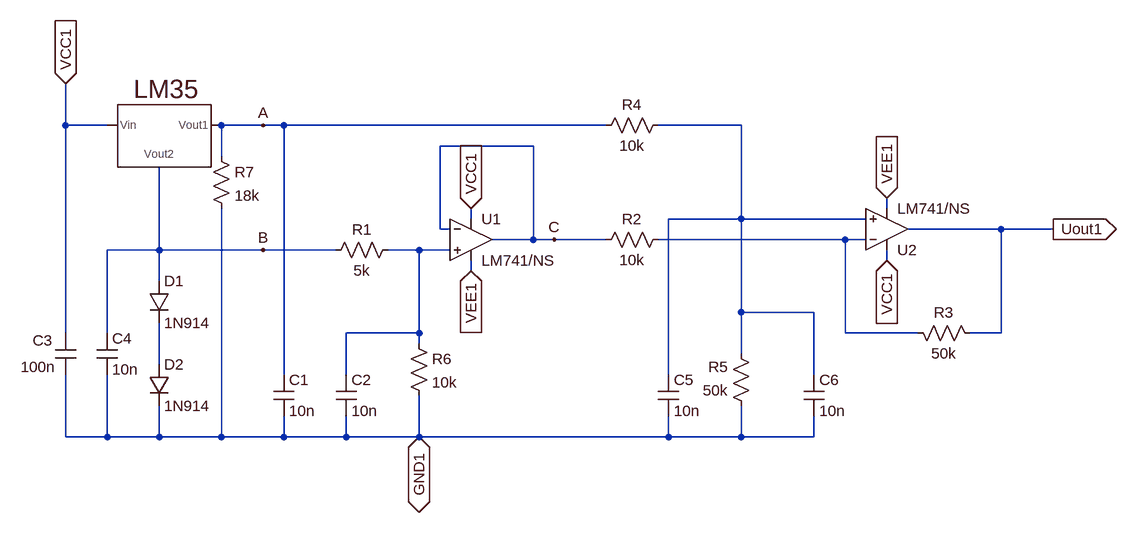
[diagram p0: schematic LM35_analog_processing.asc]
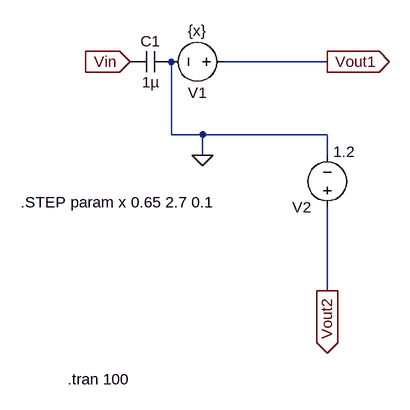
[diagram p1: sub-circuit lm35.asc]
LM35_analog_processing.asc, the LTspice schematic file:
Version 4.1
SHEET 1 1288 680
WIRE -544 -544 -544 -608
WIRE -480 -544 -544 -544
WIRE -240 -544 -304 -544
WIRE -208 -544 -240 -544
WIRE 288 -544 -208 -544
WIRE 496 -544 368 -544
WIRE 176 -512 32 -512
WIRE -304 -496 -304 -544
WIRE 720 -416 720 -432
WIRE 80 -400 80 -416
WIRE 496 -400 496 -544
WIRE 496 -400 384 -400
WIRE 688 -400 496 -400
WIRE 32 -384 32 -512
WIRE 48 -384 32 -384
WIRE 896 -384 752 -384
WIRE 976 -384 896 -384
WIRE 176 -368 176 -512
WIRE 176 -368 112 -368
WIRE 208 -368 176 -368
WIRE 288 -368 208 -368
WIRE 656 -368 368 -368
WIRE 688 -368 656 -368
WIRE -400 -352 -400 -480
WIRE -400 -352 -480 -352
WIRE -240 -352 -400 -352
WIRE -128 -352 -240 -352
WIRE 0 -352 -48 -352
WIRE 48 -352 0 -352
WIRE 720 -336 720 -352
WIRE 80 -320 80 -336
WIRE -400 -304 -400 -352
WIRE 496 -256 496 -400
WIRE 608 -256 496 -256
WIRE -544 -224 -544 -544
WIRE -480 -224 -480 -352
WIRE 0 -224 0 -352
WIRE 0 -224 -112 -224
WIRE 656 -224 656 -368
WIRE 768 -224 656 -224
WIRE 896 -224 896 -384
WIRE 896 -224 848 -224
WIRE 0 -208 0 -224
WIRE 496 -192 496 -256
WIRE -400 -176 -400 -240
WIRE -208 -160 -208 -544
WIRE -112 -160 -112 -224
WIRE 384 -160 384 -400
WIRE 608 -160 608 -256
WIRE -544 -64 -544 -160
WIRE -480 -64 -480 -160
WIRE -480 -64 -544 -64
WIRE -400 -64 -400 -112
WIRE -400 -64 -480 -64
WIRE -304 -64 -304 -416
WIRE -304 -64 -400 -64
WIRE -208 -64 -208 -96
WIRE -208 -64 -304 -64
WIRE -112 -64 -112 -96
WIRE -112 -64 -208 -64
WIRE 0 -64 0 -128
WIRE 0 -64 -112 -64
WIRE 384 -64 384 -96
WIRE 384 -64 0 -64
WIRE 496 -64 496 -112
WIRE 496 -64 384 -64
WIRE 608 -64 608 -96
WIRE 608 -64 496 -64
FLAG 208 -368 C
FLAG -240 -544 A
FLAG 976 -384 Uout1
IOPIN 976 -384 Out
FLAG -544 -608 VCC1
IOPIN -544 -608 In
FLAG -240 -352 B
FLAG 720 -432 VEE1
IOPIN 720 -432 In
FLAG 0 -64 GND1
IOPIN 0 -64 BiDir
FLAG 80 -416 VCC1
IOPIN 80 -416 In
FLAG 720 -336 VCC1
IOPIN 720 -336 In
FLAG 80 -320 VEE1
IOPIN 80 -320 In
SYMBOL Opamps\\opamp2 80 -432 R0
SYMATTR InstName U1
SYMATTR Value LM741/NS
SYMBOL res -16 -224 R0
SYMATTR InstName R6
SYMATTR Value 10k
SYMBOL res -32 -368 R90
WINDOW 0 0 56 VBottom 2
WINDOW 3 32 56 VTop 2
SYMATTR InstName R1
SYMATTR Value 5k
SYMBOL Opamps\\opamp2 720 -320 M180
SYMATTR InstName U2
SYMATTR Value LM741/NS
SYMBOL res 384 -384 R90
WINDOW 0 0 56 VBottom 2
WINDOW 3 32 56 VTop 2
SYMATTR InstName R2
SYMATTR Value 10k
SYMBOL res 864 -208 M270
WINDOW 0 32 56 VTop 2
WINDOW 3 0 56 VBottom 2
SYMATTR InstName R3
SYMATTR Value 50k
SYMBOL res 384 -560 R90
WINDOW 0 0 56 VBottom 2
WINDOW 3 32 56 VTop 2
SYMATTR InstName R4
SYMATTR Value 10k
SYMBOL res 512 -96 R180
WINDOW 0 36 76 Left 2
WINDOW 3 36 40 Left 2
SYMATTR InstName R5
SYMATTR Value 50k
SYMBOL LM35 -400 -544 R0
WINDOW 0 -39 -56 Left 4
SYMATTR InstName LM35
SYMBOL diode -416 -304 R0
SYMATTR InstName D1
SYMATTR Value 1N914
SYMBOL diode -416 -176 R0
SYMATTR InstName D2
SYMATTR Value 1N914
SYMBOL cap -560 -224 R0
WINDOW 0 -35 11 Left 2
WINDOW 3 -53 52 Left 2
SYMATTR InstName C3
SYMATTR Value 100n
SYMBOL cap -496 -224 R0
SYMATTR InstName C4
SYMATTR Value 10n
SYMBOL res -320 -512 R0
SYMATTR InstName R7
SYMATTR Value 18k
SYMBOL cap -224 -160 R0
SYMATTR InstName C1
SYMATTR Value 10n
SYMBOL cap -128 -160 R0
SYMATTR InstName C2
SYMATTR Value 10n
SYMBOL cap 368 -160 R0
SYMATTR InstName C5
SYMATTR Value 10n
SYMBOL cap 592 -160 R0
SYMATTR InstName C6
SYMATTR Value 10n

lm35.asc, the sub-circuit schematic file:
Version 4.1
SHEET 1 2188 688
WIRE 1264 128 1104 128
WIRE 1024 240 1024 128
WIRE 1072 240 1024 240
WIRE 1264 240 1072 240
WIRE 1072 272 1072 240
WIRE 1264 272 1264 240
WIRE 1264 480 1264 352
FLAG 960 128 Vin
IOPIN 960 128 In
FLAG 1264 128 Vout1
IOPIN 1264 128 Out
FLAG 1264 480 Vout2
IOPIN 1264 480 Out
FLAG 1072 272 0
SYMBOL voltage 1120 128 R90
WINDOW 0 32 56 VTop 2
WINDOW 3 -32 56 VBottom 2
WINDOW 123 0 0 Left 0
WINDOW 39 0 0 Left 0
SYMATTR InstName V1
SYMATTR Value {x}
SYMBOL voltage 1264 368 R180
WINDOW 3 -43 102 Left 2
WINDOW 123 0 0 Left 0
WINDOW 39 0 0 Left 0
SYMATTR Value 1.2
SYMATTR InstName V2
SYMBOL cap 1024 112 R90
WINDOW 0 0 32 VBottom 2
WINDOW 3 32 32 VTop 2
SYMATTR InstName C1
SYMATTR Value 1µ
TEXT 864 616 Left 2 !.tran 100
TEXT 792 344 Left 2 !.STEP param x 0.65 2.7 0.1

The netlist it stands for:
* LM35_analog_processing.asc
X§U1 N003 C VCC1 VEE1 C LM741/NS  ; pins In+ In- V+ V- OUT
R6 N003 GND1 10k
R1 N003 B 5k
X§U2 N001 N002 VCC1 VEE1 Uout1 LM741/NS  ; pins In+ In- V+ V- OUT
R2 N002 C 10k
R3 Uout1 N002 50k
R4 N001 A 10k
R5 GND1 N001 50k
X§LM35 VCC1 A B lm35
D1 B N004 1N914
D2 N004 GND1 1N914
C3 VCC1 GND1 100n
C4 B GND1 10n
R7 A GND1 18k
C1 A GND1 10n
C2 N003 GND1 10n
C5 N001 GND1 10n
C6 N001 GND1 10n

* block symbol definitions
.subckt lm35 Vin Vout1 Vout2
V1 Vout1 0 {x}
V2 Vout2 0 1.2
C1 0 Vin 1µ
.tran 100
.STEP param x 0.65 2.7 0.1
.ends lm35

.model D D
.lib standard.dio
.backanno
.end